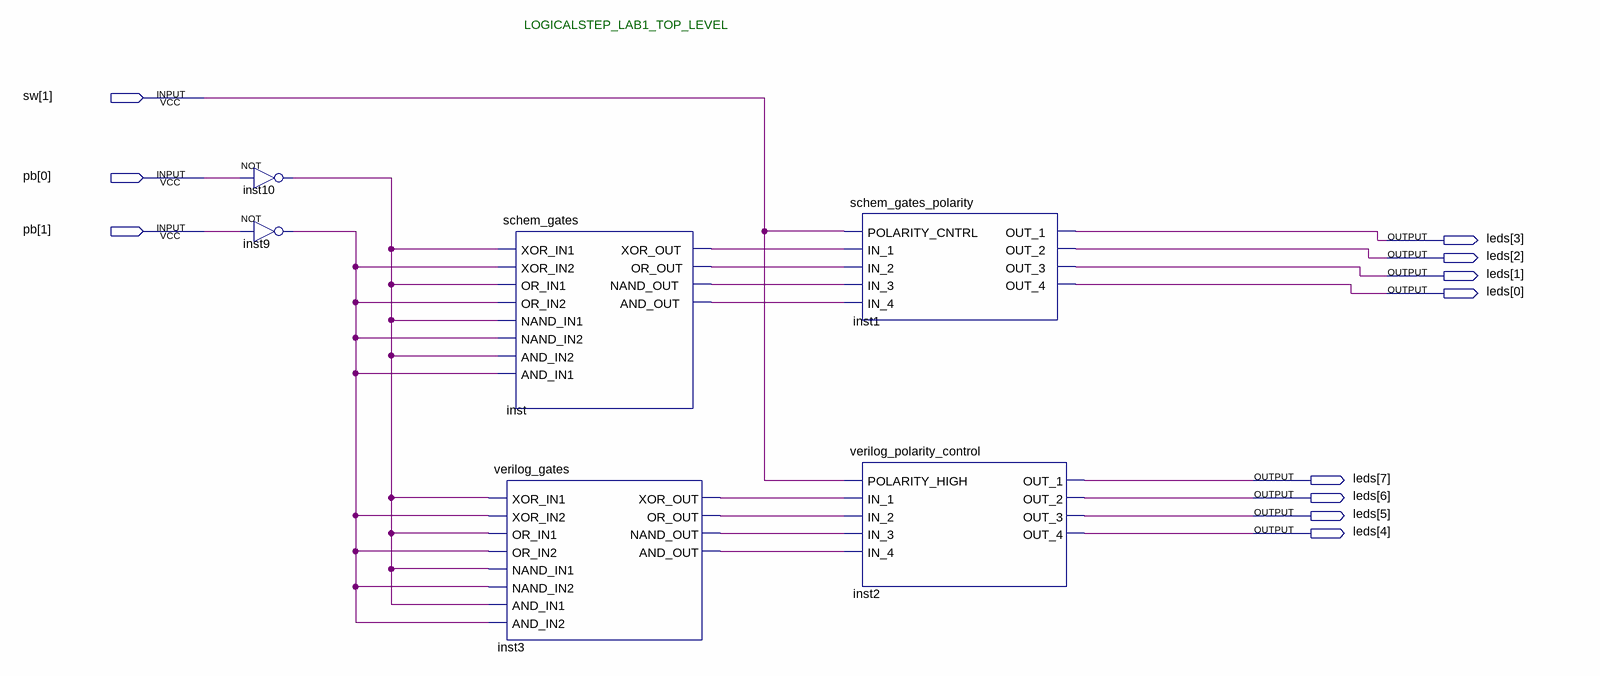
[diagram p0: schematic sheet]
// Quartus schematic LogicalStep_Lab1_top.bdf as structural Verilog: 6 symbols, 11 pins
module LogicalStep_Lab1_top (
  input  [1:1] sw,
  input  [1:0] pb,
  output [7:0] leds
);

  wire inst3_and_out, inst3_nand_out, inst3_or_out, inst3_xor_out, inst9_out, inst10_out, inst_and_out,
       inst_nand_out, inst_or_out, inst_xor_out;

  not inst10 (inst10_out, pb[0]);
  not inst9 (inst9_out, pb[1]);
  schem_gates inst (
    .XOR_IN1(inst10_out), .XOR_IN2(inst9_out), .OR_IN1(inst10_out), .OR_IN2(inst9_out),
    .NAND_IN1(inst10_out), .NAND_IN2(inst9_out), .AND_IN2(inst10_out), .AND_IN1(inst9_out),
    .XOR_OUT(inst_xor_out), .OR_OUT(inst_or_out), .NAND_OUT(inst_nand_out), .AND_OUT(inst_and_out));
  verilog_gates inst3 (
    .XOR_IN1(inst10_out), .XOR_IN2(inst9_out), .OR_IN1(inst10_out), .OR_IN2(inst9_out),
    .NAND_IN1(inst10_out), .NAND_IN2(inst9_out), .AND_IN1(inst10_out), .AND_IN2(inst9_out),
    .XOR_OUT(inst3_xor_out), .OR_OUT(inst3_or_out), .NAND_OUT(inst3_nand_out), .AND_OUT(inst3_and_out));
  schem_gates_polarity inst1 (
    .POLARITY_CNTRL(sw[1]), .IN_1(inst_xor_out), .IN_2(inst_or_out), .IN_3(inst_nand_out),
    .IN_4(inst_and_out), .OUT_1(leds[3]), .OUT_2(leds[2]), .OUT_3(leds[1]), .OUT_4(leds[0]));
  verilog_polarity_control inst2 (
    .POLARITY_HIGH(sw[1]), .IN_1(inst3_xor_out), .IN_2(inst3_or_out), .IN_3(inst3_nand_out),
    .IN_4(inst3_and_out), .OUT_1(leds[7]), .OUT_2(leds[6]), .OUT_3(leds[5]), .OUT_4(leds[4]));

  // Notes on the sheet:
  //   LOGICALSTEP_LAB1_TOP_LEVEL
endmodule
